# Altium schematic sheet Bpod Controller.SchDoc: Bpod controller
size A3; CompanyName: Forschungszentrum Jülich GmbH; DrawnBy: Daniel Hellenbrandt; Organization: IBI-TAE; Address1: Wilhelm-Johnen-Straße; Address2: 52428 Jülich; DocumentNumber: PWxxxx; Revision: 1; SheetNumber: 1; SheetTotal: 1
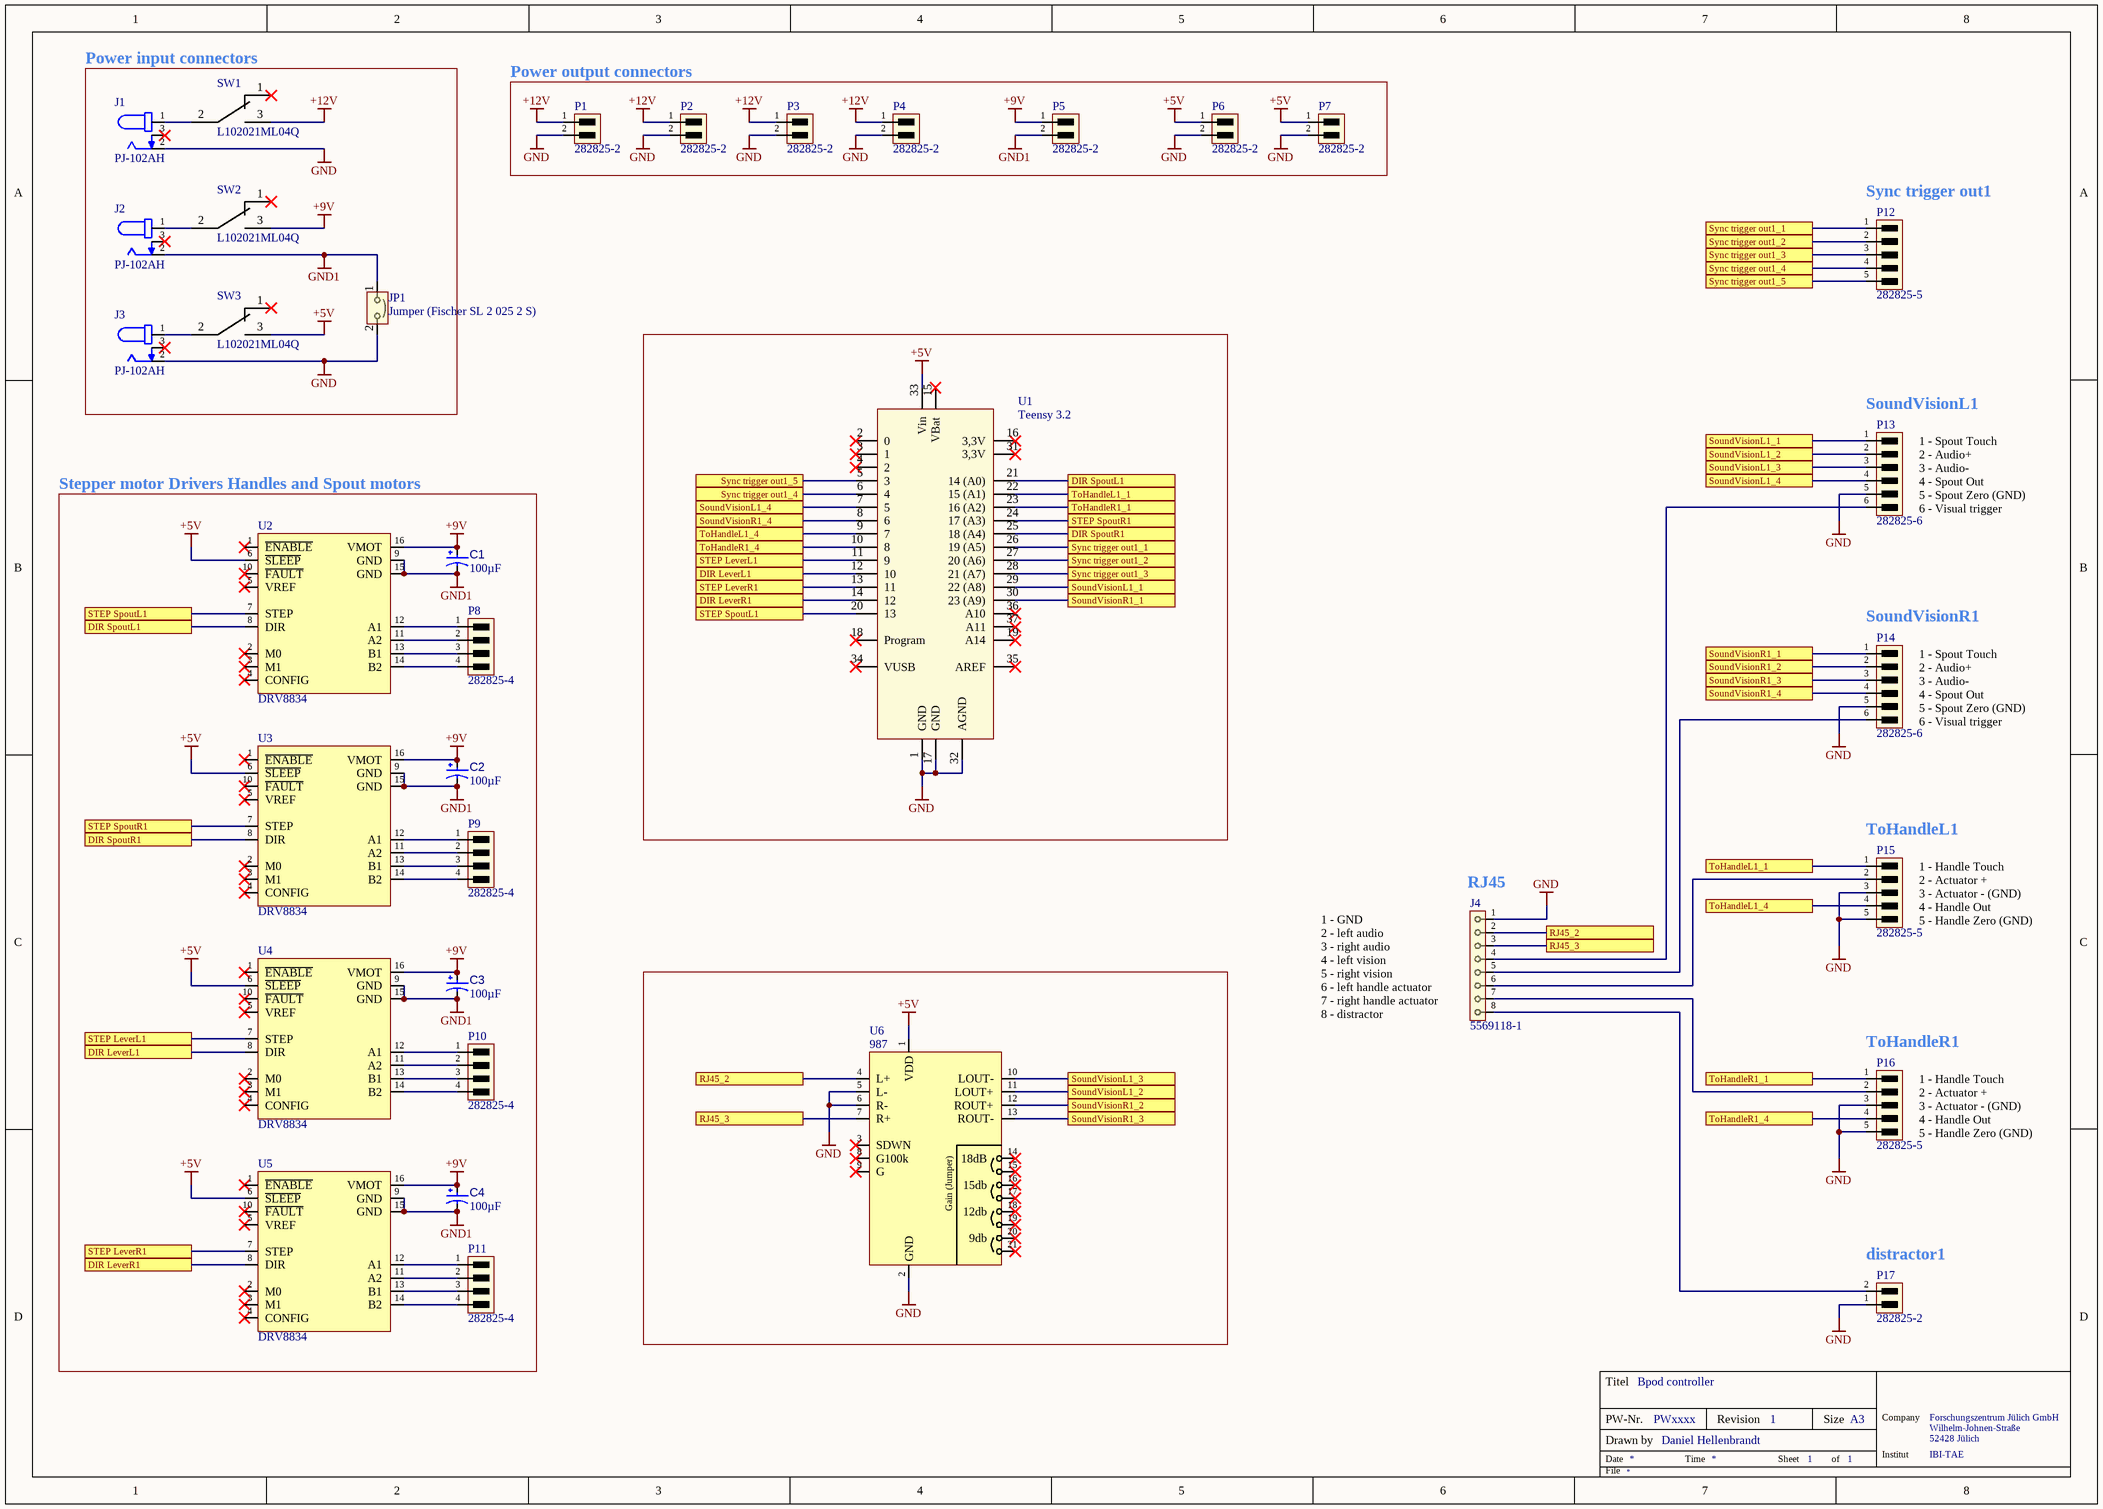
[diagram p0: Bpod Controller.SchDoc]

## Parts
C1  value 100µF  [AVX-TAJ-C-2_M]  (hidden comment: TAJC107K016RNJ)
C2  value 100µF  [AVX-TAJ-C-2_M]  (hidden comment: TAJC107K016RNJ)
C3  value 100µF  [AVX-TAJ-C-2_M]  (hidden comment: TAJC107K016RNJ)
C4  value 100µF  [AVX-TAJ-C-2_M]  (hidden comment: TAJC107K016RNJ)
J1  PJ-102AH  [CUI_PJ-102AH]
J2  PJ-102AH  [CUI_PJ-102AH]
J3  PJ-102AH  [CUI_PJ-102AH]
J4  5569118-1  [5569118-1-Footprint-1]
JP1  Jumper (Fischer SL 2 025 2 S)  [SL 2_025_ 72_S-Footprint-1]
P1  282825-2  [282825-4-Footprint-1]
P2  282825-2  [282825-4-Footprint-1]
P3  282825-2  [282825-4-Footprint-1]
P4  282825-2  [282825-4-Footprint-1]
P5  282825-2  [282825-4-Footprint-1]
P6  282825-2  [282825-4-Footprint-1]
P7  282825-2  [282825-4-Footprint-1]
P8  282825-4  [282825-4-Footprint-1]
P9  282825-4  [282825-4-Footprint-1]
P10  282825-4  [282825-4-Footprint-1]
P11  282825-4  [282825-4-Footprint-1]
P12  282825-5  [282825-4-Footprint-1]
P13  282825-6  [282825-4-Footprint-1]
P14  282825-6  [282825-4-Footprint-1]
P15  282825-5  [282825-4-Footprint-1]
P16  282825-5  [282825-4-Footprint-1]
P17  282825-2  [282825-4-Footprint-1]
SW1  L102021ML04Q  [L102021ML04Q-Footprint-1]
SW2  L102021ML04Q  [L102021ML04Q-Footprint-1]
SW3  L102021ML04Q  [L102021ML04Q-Footprint-1]
U1  Teensy 3.2  [New footprint 1]
U2  DRV8834  [DRV8825 STEPPER MOTOR DRIVER CARRIER-Footprint-1]
U3  DRV8834  [DRV8825 STEPPER MOTOR DRIVER CARRIER-Footprint-1]
U4  DRV8834  [DRV8825 STEPPER MOTOR DRIVER CARRIER-Footprint-1]
U5  DRV8834  [DRV8825 STEPPER MOTOR DRIVER CARRIER-Footprint-1]
U6  987  [987-Footprint-1]

## Blocks framed on the sheet
Power input connectors: J1-J3 JP1 SW1-SW3
Power output connectors: P1-P7
Stepper motor Drivers Handles and Spout motors: C1-C4 P8-P11 U2-U5

## Ports
DIR LeverL1 (see Bpod Controller[1C]), DIR LeverL1 (see Bpod Controller[3B]), DIR LeverR1 (see Bpod Controller[1D]), DIR LeverR1 (see Bpod Controller[3B]), DIR SpoutL1 (see Bpod Controller[1B]), DIR SpoutL1 (see Bpod Controller[5B]), DIR SpoutR1 (see Bpod Controller[1C]), DIR SpoutR1 (see Bpod Controller[5B]), RJ45_2 (see Bpod Controller[3C]), RJ45_2 (see Bpod Controller[6C]), RJ45_3 (see Bpod Controller[3C]), RJ45_3 (see Bpod Controller[6C]), SoundVisionL1_1 (see Bpod Controller[5B]), SoundVisionL1_1 (see Bpod Controller[7B]), SoundVisionL1_2 (see Bpod Controller[5C]), SoundVisionL1_2 (see Bpod Controller[7B]), SoundVisionL1_3 (see Bpod Controller[5C]), SoundVisionL1_3 (see Bpod Controller[7B]), SoundVisionL1_4 (see Bpod Controller[3B]), SoundVisionL1_4 (see Bpod Controller[7B]), SoundVisionR1_1 (see Bpod Controller[5B]), SoundVisionR1_1 (see Bpod Controller[7B]), SoundVisionR1_2 (see Bpod Controller[5C]), SoundVisionR1_2 (see Bpod Controller[7B]), SoundVisionR1_3 (see Bpod Controller[5C]), SoundVisionR1_3 (see Bpod Controller[7B]), SoundVisionR1_4 (see Bpod Controller[3B]), SoundVisionR1_4 (see Bpod Controller[7B]), STEP LeverL1 (see Bpod Controller[1C]), STEP LeverL1 (see Bpod Controller[3B]), STEP LeverR1 (see Bpod Controller[1D]), STEP LeverR1 (see Bpod Controller[3B]), STEP SpoutL1 (see Bpod Controller[1B]), STEP SpoutL1 (see Bpod Controller[3B]), STEP SpoutR1 (see Bpod Controller[1C]), STEP SpoutR1 (see Bpod Controller[5B]), Sync trigger out1_1 (see Bpod Controller[5B]), Sync trigger out1_1 (see Bpod Controller[7A]), Sync trigger out1_2 (see Bpod Controller[5B]), Sync trigger out1_2 (see Bpod Controller[7A]), Sync trigger out1_3 (see Bpod Controller[5B]), Sync trigger out1_3 (see Bpod Controller[7A]), Sync trigger out1_4 (see Bpod Controller[3B]), Sync trigger out1_4 (see Bpod Controller[7A]), Sync trigger out1_5 (see Bpod Controller[3B]), Sync trigger out1_5 (see Bpod Controller[7A]), ToHandleL1_1 (see Bpod Controller[5B]), ToHandleL1_1 (see Bpod Controller[7C]), ToHandleL1_4 (see Bpod Controller[3B]), ToHandleL1_4 (see Bpod Controller[7C]), ToHandleR1_1 (see Bpod Controller[5B]), ToHandleR1_1 (see Bpod Controller[7C]), ToHandleR1_4 (see Bpod Controller[3B]), ToHandleR1_4 (see Bpod Controller[7C])

## Nets
+5V: P6.1 P7.1 SW3.3 U1.33(Vin) U2.6(~{SLEEP}) U3.6(~{SLEEP}) U4.6(~{SLEEP}) U5.6(~{SLEEP}) U6.1(VDD)
+9V: C1.1 C2.1 C3.1 C4.1 P5.1 SW2.3 U2.16(VMOT) U3.16(VMOT) U4.16(VMOT) U5.16(VMOT)
+12V: P1.1 P2.1 P3.1 P4.1 SW1.3
GND: J1.2 J3.2 J4.1 JP1.2 P1.2 P2.2 P3.2 P4.2 P6.2 P7.2 P13.5 P14.5 P15.3 P15.5 P16.3 P16.5 P17.1 U1.1(GND) U1.17(GND) U1.32(AGND) U6.2(GND) U6.5(L-) U6.6(R-)
GND1: C1.2 C2.2 C3.2 C4.2 J2.2 JP1.1 P5.2 U2.9(GND) U2.15(GND) U3.9(GND) U3.15(GND) U4.9(GND) U4.15(GND) U5.9(GND) U5.15(GND)
DIR LeverL1: U1.12(10) U4.8(DIR) ; port DIR LeverL1
DIR LeverR1: U1.14(12) U5.8(DIR) ; port DIR LeverR1
DIR SpoutL1: U1.21(14_(A0)) U2.8(DIR) ; port DIR SpoutL1
DIR SpoutR1: U1.25(18_(A4)) U3.8(DIR) ; port DIR SpoutR1
RJ45_2: J4.2 U6.4(L+) ; port RJ45_2
RJ45_3: J4.3 U6.7(R+) ; port RJ45_3
SoundVisionL1_1: P13.1 U1.29(22_(A8)) ; port SoundVisionL1_1
SoundVisionL1_2: P13.2 U6.11(LOUT+) ; port SoundVisionL1_2
SoundVisionL1_3: P13.3 U6.10(LOUT-) ; port SoundVisionL1_3
SoundVisionL1_4: P13.4 U1.7(5) ; port SoundVisionL1_4
SoundVisionR1_1: P14.1 U1.30(23_(A9)) ; port SoundVisionR1_1
SoundVisionR1_2: P14.2 U6.12(ROUT+) ; port SoundVisionR1_2
SoundVisionR1_3: P14.3 U6.13(ROUT-) ; port SoundVisionR1_3
SoundVisionR1_4: P14.4 U1.8(6) ; port SoundVisionR1_4
STEP LeverL1: U1.11(9) U4.7(STEP) ; port STEP LeverL1
STEP LeverR1: U1.13(11) U5.7(STEP) ; port STEP LeverR1
STEP SpoutL1: U1.20(13) U2.7(STEP) ; port STEP SpoutL1
STEP SpoutR1: U1.24(17_(A3)) U3.7(STEP) ; port STEP SpoutR1
Sync trigger out1_1: P12.1 U1.26(19_(A5)) ; port Sync trigger out1_1
Sync trigger out1_2: P12.2 U1.27(20_(A6)) ; port Sync trigger out1_2
Sync trigger out1_3: P12.3 U1.28(21_(A7)) ; port Sync trigger out1_3
Sync trigger out1_4: P12.4 U1.6(4) ; port Sync trigger out1_4
Sync trigger out1_5: P12.5 U1.5(3) ; port Sync trigger out1_5
ToHandleL1_1: P15.1 U1.22(15_(A1)) ; port ToHandleL1_1
ToHandleL1_4: P15.4 U1.9(7) ; port ToHandleL1_4
ToHandleR1_1: P16.1 U1.23(16_(A2)) ; port ToHandleR1_1
ToHandleR1_4: P16.4 U1.10(8) ; port ToHandleR1_4
NetJ1_1: J1.1 SW1.2
NetJ2_1: J2.1 SW2.2
NetJ3_1: J3.1 SW3.2
NetJ4_4: J4.4 P13.6
NetJ4_5: J4.5 P14.6
NetJ4_6: J4.6 P15.2
NetJ4_7: J4.7 P16.2
NetJ4_8: J4.8 P17.2
NetP8_1: P8.1 U2.12(A1)
NetP8_2: P8.2 U2.11(A2)
NetP8_3: P8.3 U2.13(B1)
NetP8_4: P8.4 U2.14(B2)
NetP9_1: P9.1 U3.12(A1)
NetP9_2: P9.2 U3.11(A2)
NetP9_3: P9.3 U3.13(B1)
NetP9_4: P9.4 U3.14(B2)
NetP10_1: P10.1 U4.12(A1)
NetP10_2: P10.2 U4.11(A2)
NetP10_3: P10.3 U4.13(B1)
NetP10_4: P10.4 U4.14(B2)
NetP11_1: P11.1 U5.12(A1)
NetP11_2: P11.2 U5.11(A2)
NetP11_3: P11.3 U5.13(B1)
NetP11_4: P11.4 U5.14(B2)

Not connected (* = marked no-connect by the designer): J1 3*; J2 3*; J3 3*; SW1 1*; SW2 1*; SW3 1*; U1 2(0)* 3(1)* 4(2)* 15(VBat)* 16(3,3V)* 18(Program)* 19(A14)* 31(3,3V)* 34(VUSB)* 35(AREF)* 36(A10)* 37(A11)*; U2 1(~{ENABLE})* 2(M0)* 3(M1)* 4(CONFIG)* 5(VREF)* 10(~{FAULT})*; U3 1(~{ENABLE})* 2(M0)* 3(M1)* 4(CONFIG)* 5(VREF)* 10(~{FAULT})*; U4 1(~{ENABLE})* 2(M0)* 3(M1)* 4(CONFIG)* 5(VREF)* 10(~{FAULT})*; U5 1(~{ENABLE})* 2(M0)* 3(M1)* 4(CONFIG)* 5(VREF)* 10(~{FAULT})*; U6 3(SDWN)* 8(G100k)* 9(G)* 14(18dB)* 15* 16(15db)* 17* 18(12db)* 19* 20(9db)* 21* 22(X) 23(Y)

## Notes on the sheet
- (near P12) Sync trigger out1
- (near P13) SoundVisionL1
- (near P13) 1 - Spout Touch
  2 - Audio+
  3 - Audio-
  4 - Spout Out
  5 - Spout Zero (GND)
  6 - Visual trigger
- (near P14) SoundVisionR1
- (near P14) 1 - Spout Touch
  2 - Audio+
  3 - Audio-
  4 - Spout Out
  5 - Spout Zero (GND)
  6 - Visual trigger
- (near P15) ToHandleL1
- (near J4) RJ45
- (near P15) 1 - Handle Touch
  2 - Actuator +
  3 - Actuator - (GND)
  4 - Handle Out
  5 - Handle Zero (GND)
- (near J4) 1 - GND
  2 - left audio
  3 - right audio
  4 - left vision
  5 - right vision
  6 - left handle actuator
  7 - right handle actuator
  8 - distractor
- (near P16) ToHandleR1
- (near P16) 1 - Handle Touch
  2 - Actuator +
  3 - Actuator - (GND)
  4 - Handle Out
  5 - Handle Zero (GND)
- (near P17) distractor1
- Titel
- PW-Nr.
- Date
- Drawn by
- Time
- Revision
- Sheet
- Size
- of
- A3
- Institut
- Company
- File
- (in symbol CMP-00027-00003-5) Gain (Jumper)

## Library data of the parts
C1-C4 = CMP-001-00046-9: Standard Tantalum, 100 uF, +/- 10%, 16 V, -55 to 125 degC, 2312 (6032 Metric), RoHS, Tape and Reel; Manufacturer: AVX; Voltage Rating: 16V; Resistance: 1Ohm; Package Quantity: 500; Max Operating Temperature: 125°C; Datasheet URL: http://datasheets.avx.com/TAJ.pdf; Case/Package: 2412; RoHS Compliant: True; Tolerance: 10%; Manufacturer URL: http://www.avx.com/; Packaging: TapeandReel; Package Reference: TAJ-C-2; Min Operating Temperature: -55°C; Package Description: 2-Pin Surface Mount Device, Body 6 x 3.25 mm; Mounting Technology: SM; ESR: 1Ohm; Capacitor Type: Tantalum; Datasheet Version: Feb-16
J1-J3 = CMP-00027-00002-4: 12V, 2.5A, 2mm Dia; user: IBI-TAE; Pins: 3; Mounting Technology: Board; RoHS Compliant: Yes
J4 = CMP-002-00096-4: Telecom and Datacom Connector, 8 Contact(s), Female, Right Angle, Solder Terminal, Locking, Jack; User: IBI-TAE; RoHS Compliant: Yes; Min Operating Temperature: -40°C; Mounting Technology: Panel,Board; Max Operating Temperature: 85°C; Connector Type: TELECOM AND DATACOM CONNECTOR; Case/Package: RJ45; Pins: 8
JP1 = CMP-002-00095-3: Fischer Elektronik SL 2/025/ 72/S; user: IBI-TAE; Link: https://www.fischerelektronik.de/web_fischer/de_DE/Steckverbinder/G01/Stiftleisten/$catalogue/fischerData/PR/SL%202%20025/
P1-P7 P17 = CMP-002-00093-2: Strip Terminal Block, 15A, 1 Row(s), 1 Deck(s); Gender: male; Connector Type: Pluggable Terminal Block; user: IBI-TAE; Voltage Rating: 300V; RoHS Compliant: Yes; Max Current Rating: 15A; Mounting Technology: Board; Pins: 4
P8-P11 = CMP-002-00090-2: Strip Terminal Block, 15A, 1 Row(s), 1 Deck(s); user: IBI-TAE; Connector Type: Pluggable Terminal Block; Gender: male; Voltage Rating: 300V; RoHS Compliant: Yes; Pins: 4; Max Current Rating: 15A; Mounting Technology: Board
P12 P15 P16 = CMP-002-00091-3: Strip Terminal Block, 15A, 1 Row(s), 1 Deck(s); Connector Type: Pluggable Terminal Block; user: IBI-TAE; Gender: male; Voltage Rating: 300V; Pins: 5; Mounting Technology: Board; RoHS Compliant: Yes; Max Current Rating: 15A
P13 P14 = CMP-002-00092-3: Strip Terminal Block, 15A, 1 Row(s), 1 Deck(s); Gender: male; Connector Type: Pluggable Terminal Block; Voltage Rating: 300V; user: IBI-TAE; Pins: 6; Max Current Rating: 15A; RoHS Compliant: Yes; Mounting Technology: Board
SW1-SW3 = CMP-011-00017-3: Slide Switch, 1 Positions, SPDT, Latched, 4A, 28VDC, Solder Terminal, Through Hole-right Angle; Mounting Technology: Through Hole; Max Operating Temperature: 65°C; Min Operating Temperature: -30°C; RoHS Compliant: Yes
U1 = CMP-00000-5: Development Boards & Kits, ARM Teensy 3.2 and header; user: IBI-TAE
U2-U5 = CMP-00024-00007-1: DRV8834 Low-Voltage Stepper Motor Driver Carrier; Min Supply Voltage: 2,5V; Max current per phase: 2A; Continuous current per phase: 1,5A; user: IBI-TAE; Max Supply Voltage: 10,8V; website: https://www.pololu.com/product/2134; Pins: 16
U6 = CMP-00027-00003-5: Stereo 3.7W Class D Amplifier - Max98306; Product Range: -; Plug Type: - Rohs Compliant: Yes; user: IBI-TAE